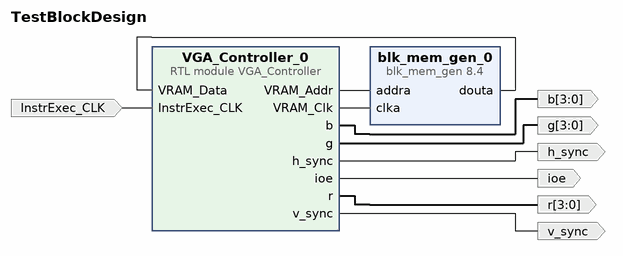
[diagram p0: block diagram of the top level]
# Vivado block design TestBlockDesign, xc7a35ticsg324-1L, Vivado 2024.1
create_bd_design TestBlockDesign

create_bd_port -dir I -type clk InstrExec_CLK
set_property -dict {CONFIG.FREQ_HZ 100000000} [get_bd_ports InstrExec_CLK]
create_bd_port -dir O -from 3 -to 0 r
create_bd_port -dir O -from 3 -to 0 g
create_bd_port -dir O -from 3 -to 0 b
create_bd_port -dir O ioe
create_bd_port -dir O h_sync
create_bd_port -dir O v_sync

create_bd_cell -type module -reference VGA_Controller VGA_Controller_0
create_bd_cell -type ip -vlnv xilinx.com:ip:blk_mem_gen:8.4 blk_mem_gen_0
set_property -dict [list \
  CONFIG.Algorithm Fixed_Primitives \
  CONFIG.Coe_File ../../../../../../../../tools/hex2coe/Debug.coe \
  CONFIG.Enable_A Always_Enabled \
  CONFIG.Fill_Remaining_Memory_Locations true \
  CONFIG.Load_Init_File true \
  CONFIG.Operating_Mode_A READ_FIRST \
  CONFIG.Register_PortA_Output_of_Memory_Primitives true \
  CONFIG.Remaining_Memory_Locations f80 \
  CONFIG.Write_Depth_A 32768 \
  CONFIG.Write_Width_A 12 \
  CONFIG.use_bram_block Stand_Alone \
] [get_bd_cells blk_mem_gen_0]

# ---- connections ----

connect_bd_net [get_bd_ports InstrExec_CLK] [get_bd_pins VGA_Controller_0/InstrExec_CLK]
connect_bd_net [get_bd_pins VGA_Controller_0/VRAM_Addr] [get_bd_pins blk_mem_gen_0/addra]
connect_bd_net [get_bd_pins VGA_Controller_0/VRAM_Clk] [get_bd_pins blk_mem_gen_0/clka]
connect_bd_net [get_bd_pins VGA_Controller_0/b] [get_bd_ports b]
connect_bd_net [get_bd_pins VGA_Controller_0/g] [get_bd_ports g]
connect_bd_net [get_bd_pins VGA_Controller_0/h_sync] [get_bd_ports h_sync]
connect_bd_net [get_bd_pins VGA_Controller_0/ioe] [get_bd_ports ioe]
connect_bd_net [get_bd_pins VGA_Controller_0/r] [get_bd_ports r]
connect_bd_net [get_bd_pins VGA_Controller_0/v_sync] [get_bd_ports v_sync]
connect_bd_net [get_bd_pins blk_mem_gen_0/douta] [get_bd_pins VGA_Controller_0/VRAM_Data]

validate_bd_design
save_bd_design
